# Altium schematic sheet BalanceAdapter.SchDoc
size A4
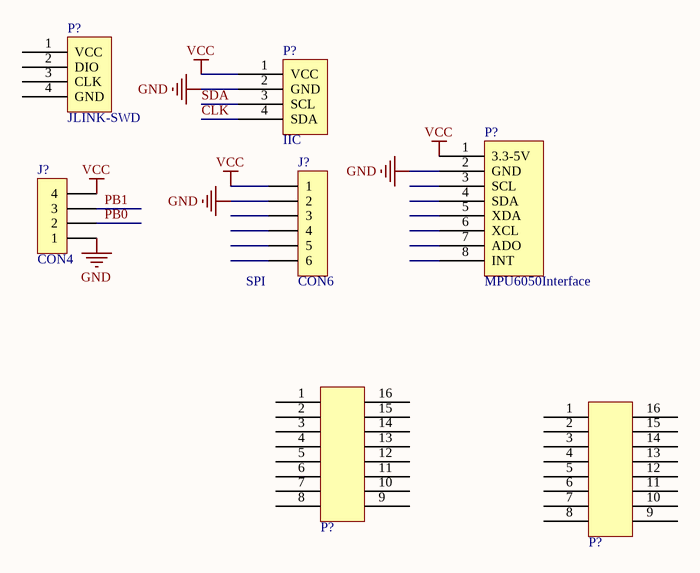
[diagram p0: BalanceAdapter.SchDoc]

## Parts
(Parts that share a designator on the sheet are numbered #1, #2 ... from top to bottom, then left to right.)
J?#1  CON6  [DG1286-5.0]
J?#2  CON4  [DG1284-5.0]
P?#1  JLINK-SWD
P?#2  IIC
P?#3  MPU6050Interface
P?#4  CON2X8  (value not drawn)
P?#5  CON2X8  (value not drawn)

## Nets
GND: J?#1.2 J?#2.1 P?#2.2(GND) P?#3.2(GND)
VCC: J?#1.1 J?#2.4 P?#2.1(VCC) P?#3.1(3.3-5V)
CLK: P?#2.4(SDA)
PB0: J?#2.2
PB1: J?#2.3
SDA: P?#2.3(SCL)

Not connected (* = marked no-connect by the designer): J?#1 3 4 5 6; P?#1 1(VCC) 2(DIO) 3(CLK) 4(GND); P?#3 3(SCL) 4(SDA) 5(XDA) 6(XCL) 7(ADO) 8(INT); P?#4 1 2 3 4 5 6 7 8 9 10 11 12 13 14 15 16; P?#5 1 2 3 4 5 6 7 8 9 10 11 12 13 14 15 16

## Notes on the sheet
- (near J?#1) SPI

## Library data of the parts
P?#3 = MPU6050